# EasyEDA Pro project ProPrj_STM32的智能蓝牙药盒系统_2026-03-19.epro

# Schematic Schematic1
Assembly Variant: Basic; Board Name: Board1; Create Date: 2026-03-02; Page Name: P1; Project Name: STM32的智能蓝牙药盒系统; Schematic Name: Schematic1; Update Date: 2026-03-02; BladeWidth: 10; Company: 嘉立创EDA; Page Size: A4; RegionStart: 1; ShowBorder: 1; TitleBlock: 1; TitleBlockPosition: 3; Version: V1.0; XRegionCount: 6; YRegionCount: 4
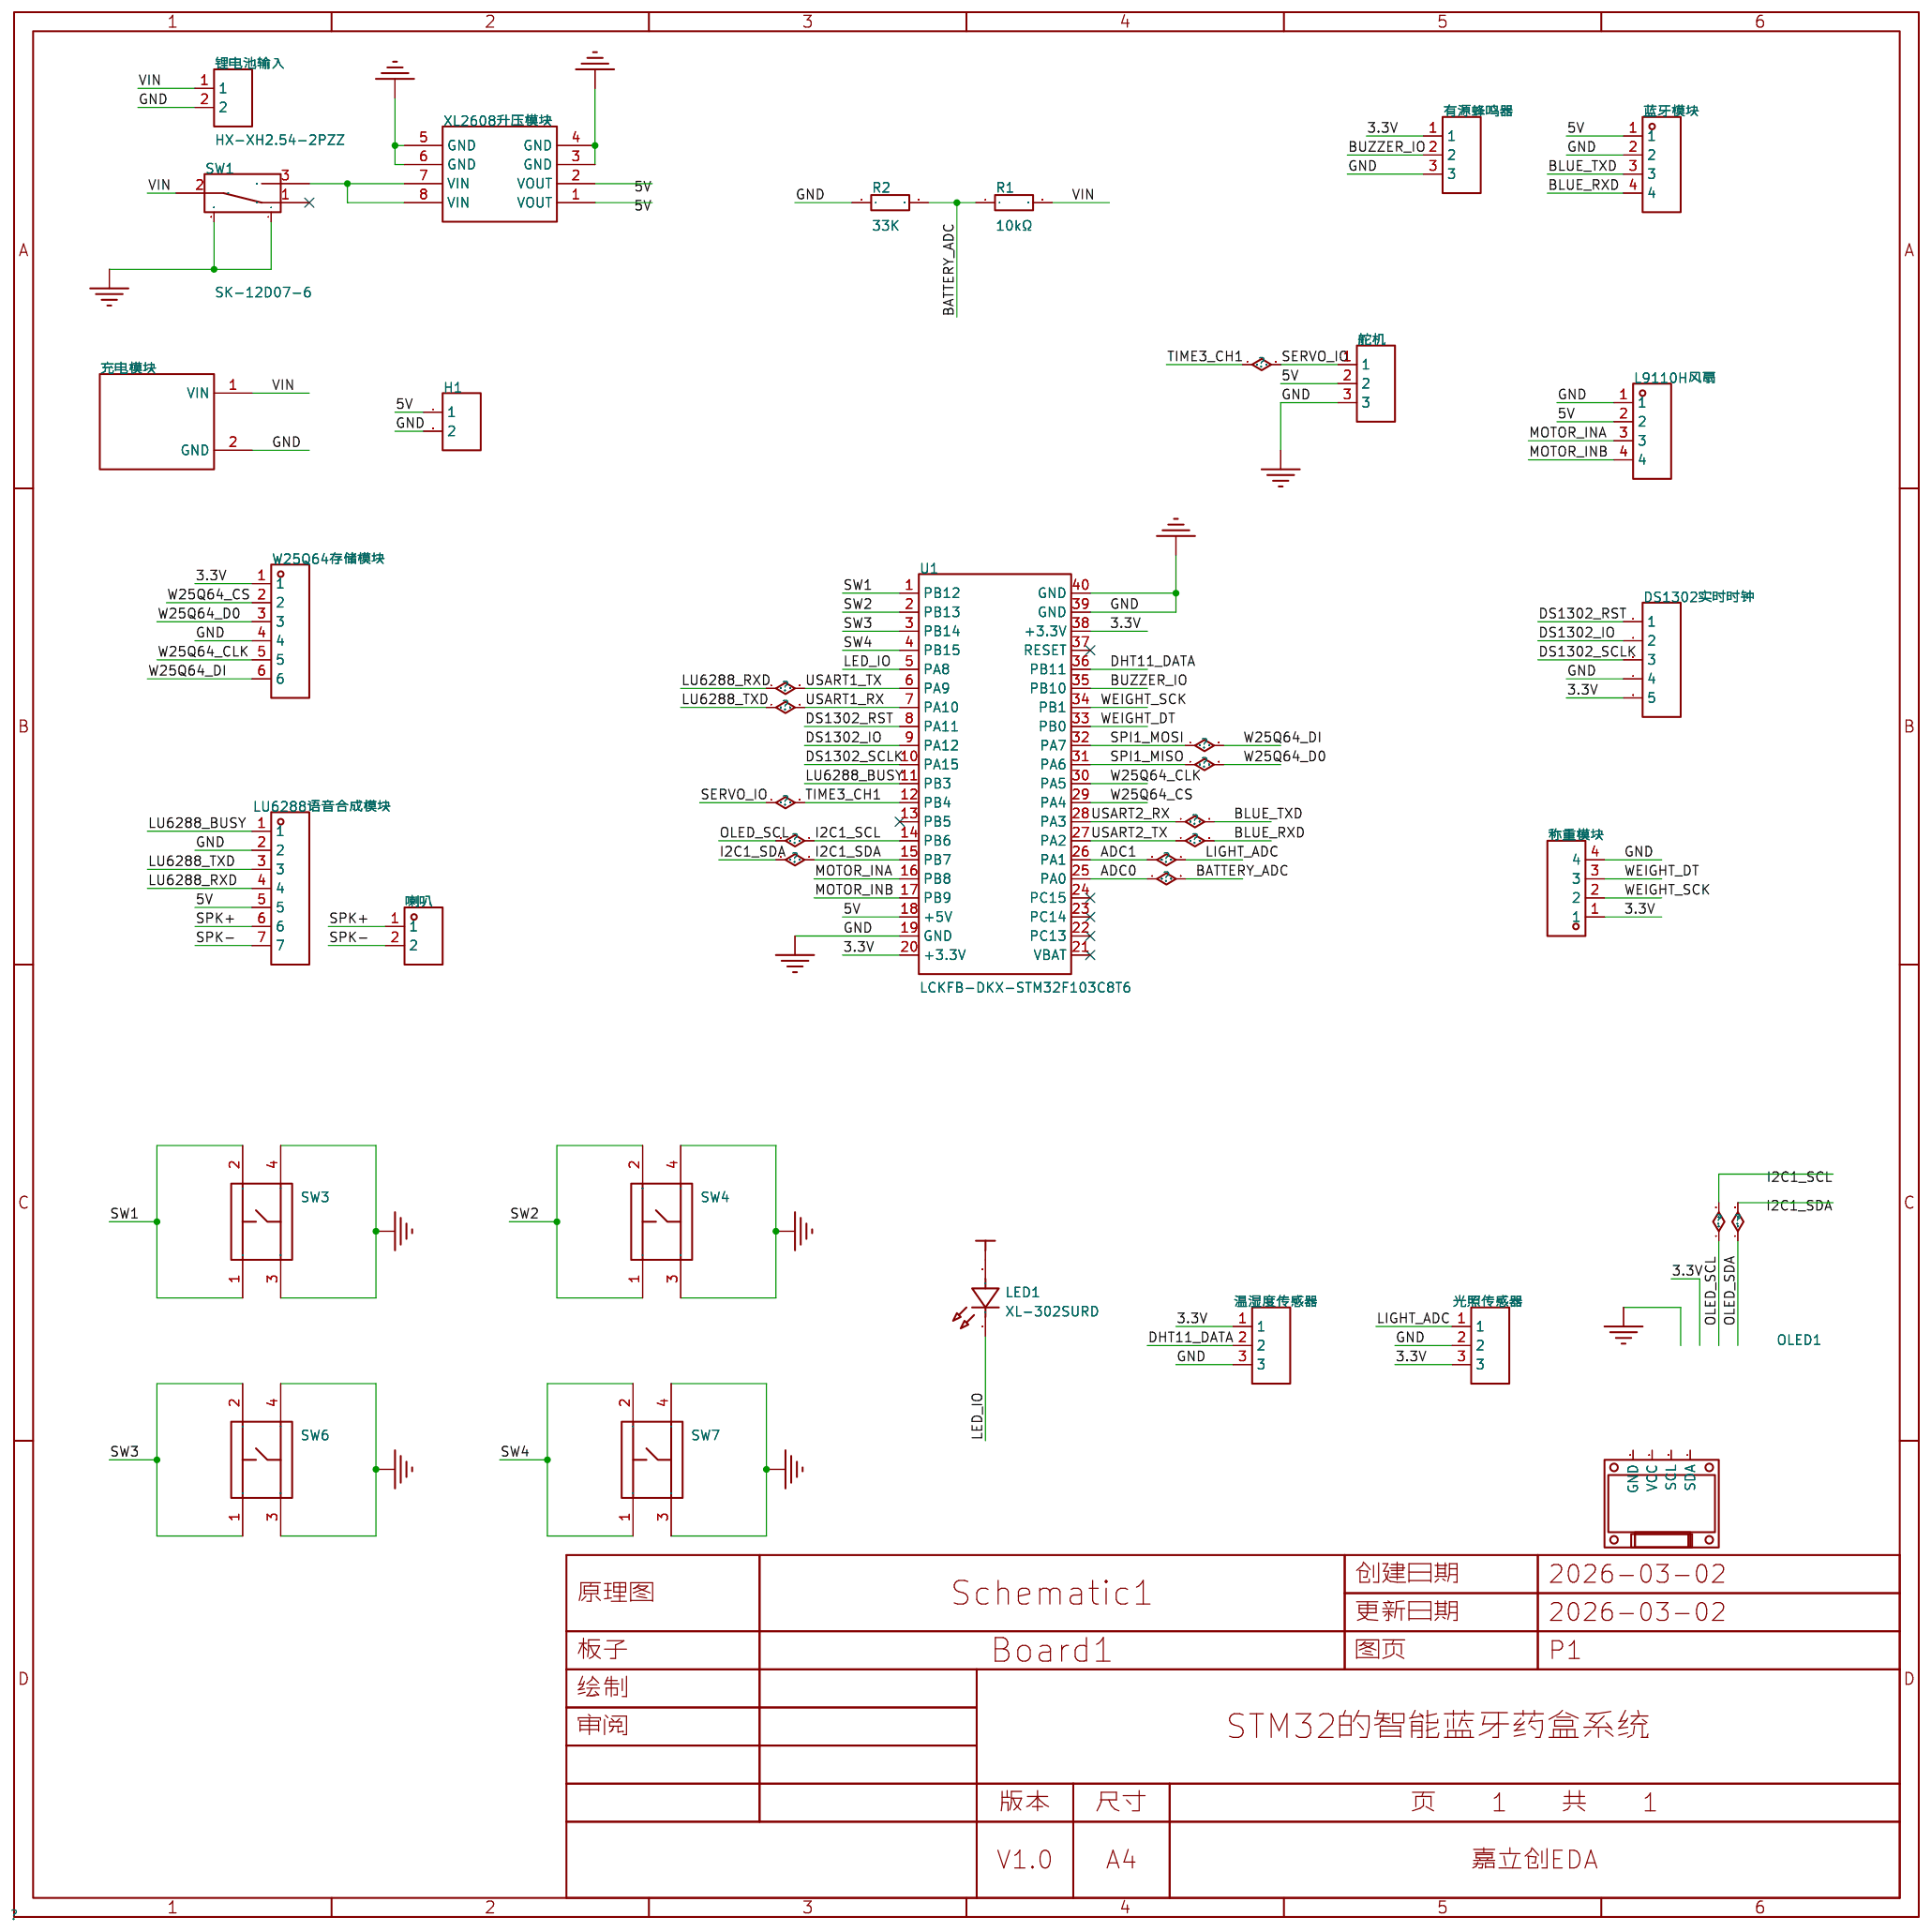
[diagram p0: schematic sheet]

## Parts
DS1302实时时钟  2.54-1*5P母  [HDR-TH_5P-P2.54-V-F]
H1  -  [HDR-TH_2P-P2.54-V-F]
L9110H风扇  -  [HDR-TH_4P-P2.54-V-F]
LED1  XL-302SURD  [LED-TH_BD3.8-P2.54-RD]
LU6288语音合成模块  PM254V-11-07-H85  [HDR-TH_7P-P2.54-V-F]
OLED1  -  [0.96OLED_4P]
R1  10kΩ  [R0805]
R2  33K  [R0805]
SW1  SK-12D07-6  [拨动开关_侧]
SW3  K2-1102DP-C4SW-04  [KEY-TH_4P-L6.0-W6.0-P4.50-LS6.50]
SW4  K2-1102DP-C4SW-04  [KEY-TH_4P-L6.0-W6.0-P4.50-LS6.50]
SW6  K2-1102DP-C4SW-04  [KEY-TH_4P-L6.0-W6.0-P4.50-LS6.50]
SW7  K2-1102DP-C4SW-04  [KEY-TH_4P-L6.0-W6.0-P4.50-LS6.50]
U1  LCKFB-DKX-STM32F103C8T6  [CONN-TH_L53.3-W22.9_STM32F103C8T6-CARD]
W25Q64存储模块  PM254V-11-06-H85  [HDR-TH_6P-P2.54-V-F]
XL2608升压模块  -  [XL3608升压模块]
充电模块  -  [充电模块]
光照传感器  PM254V-11-03-H85  [HDR-TH_3P-P2.54-V-F]
喇叭  WAFER-PH2.0-2PZZ  [CONN-TH_2P-P2.00_HC-PH-2A-M]
有源蜂鸣器  PM254V-11-03-H85  [HDR-TH_3P-P2.54-V-F]
温湿度传感器  PM254V-11-03-H85  [HDR-TH_3P-P2.54-V-F]
称重模块  -  [HDR-TH_4P-P2.54-V-F]
舵机  PM254V-11-03-H85  [HDR-TH_3P-P2.54-V-F]
蓝牙模块  -  [HDR-TH_4P-P2.54-V-F]
锂电池输入  HX-XH2.54-2PZZ  [CONN-TH_2P-P2.50_HX-2.54MM-2P-ZZ-MS]

## Library data of the parts
DS1302实时时钟 = 2.54-1*5P母: 插孔结构:1x5P;间距:2.54mm;行距:-;圆孔/方孔:方孔;安装方式:直插;排数:单排;总孔位数:5P;额定电流:3A;插孔方向:顶部;塑高:8.5mm;触头材质:黄铜;触头镀层:金;工作温度:-55℃~+105℃;; LCSC Part Name: 1x5P 间距:2.54mm 直插; Supplier Part: C50950; Manufacturer: BOOMELE(博穆精密); Supplier Footprint: 插件,P=2.54mm; JLCPCB Part Class: Extended Part; Datasheet: https://item.szlcsc.com/datasheet/2.54-1*5P%25E6%25AF%258D/51962.html; Supplier: LCSC; Holes Structure: 1x5P; Pitch: 2.54mm; Circular Hole / Square Hole: 方孔; Mounting Type: 直插; Number of Rows: 单排; Number of Positions: 5P; Current Rating: 3A; Holes Direction: 顶部; Insulation Height: 8.5mm; Contact Material: 黄铜; Contact Plating: 金; Operating Temperature: -55℃~+105℃; PIN Length: 3.2mm
H1 = HDR-F_2.54_1x2P: Supplier Part: C49661; Supplier Footprint: 插件
L9110H风扇 称重模块 蓝牙模块 = HDR-F_2.54_1x4P: Supplier Part: C2718488; Supplier Footprint: 插件
LED1 = XL-302SURD: 灯头类型:3mm圆形灯头;发光颜色:红色;正向压降(Vf):2.2V;功率:50mW;正向电流:20mA;波长:620nm~630nm;二极管配置:-;透镜颜色:红色透镜;色温:-;发光强度:1000mcd;发光角度:35°;载带方式:-;工作温度:-20℃~+85℃;; LCSC Part Name: 3mm圆形灯头 红色; Supplier Part: C2895470; Manufacturer: XINGLIGHT(成兴光); Supplier Footprint: 插件,D=3mm; JLCPCB Part Class: Extended Part; Datasheet: https://item.szlcsc.com/datasheet/XL-302SURD/3136185.html; Supplier: LCSC; Lamp Holder Type: 3mm圆形灯头; Illumination Color: 红色; Voltage - Forward(Vf): 2.2V; Power(Watts): 50mW; Forward Current: 20mA; Wavelength - Dominant: 620nm~630nm; Peak Wavelength: 625nm; Lens Color: 红色透镜; Luminous Intensity: 1000mcd; Viewing Angle: 35°; Operating Temperature: -20℃~+85℃
LU6288语音合成模块 = PM254V-11-07-H85: 插孔结构:1x7P;间距:2.54mm;行距:-;圆孔/方孔:方孔;安装方式:直插;排数:单排;总孔位数:7P;额定电流:3A;额定电压:250V;插孔方向:顶部;塑高:-;工作温度:-40℃~+105℃;; LCSC Part Name: 间距:2.54mm 1x7P 直插; Supplier Part: C2832270; Manufacturer: XFCN(兴飞); Supplier Footprint: 插件,P=2.54mm; JLCPCB Part Class: Extended Part; Datasheet: https://item.szlcsc.com/datasheet/PM254V-11-07-H85/2989788.html; Supplier: LCSC; Holes Structure: 1x7P; Pitch: 2.54mm; Circular Hole / Square Hole: 方孔; Mounting Type: 直插; Number of Rows: 单排; Number of Positions: 7P; Current Rating: 3A; Voltage Rating (Max): 250V; Holes Direction: 顶部; Operating Temperature: -40℃~+105℃
OLED1 = 0.96OLED模块_4P: Supplier Footprint: 插件
R1 R2 = 0805W8F1002T5E_C17414: 电阻类型:厚膜电阻;阻值:10kΩ;精度:±1%;功率:125mW;工作电压:150V;温度系数:±100ppm/℃;; LCSC Part Name: 10kΩ ±1% 125mW 厚膜电阻; Supplier Part: C17414; Manufacturer: UNI-ROYAL(厚声); Manufacturer Part: 0805W8F1002T5E; Supplier Footprint: 0805; JLCPCB Part Class: Basic Part; Datasheet: https://item.szlcsc.com/datasheet/0805W8F1002T5E/18102.html; Supplier: LCSC; Type: 厚膜电阻; Tolerance: ±1%; Power(Watts): 125mW; Voltage-Supply(Max): 150V; Temperature Coefficient: ±100ppm/℃; Operating Temperature: -55℃~+155℃
SW1 = SK-12D07-6: 安装方式:弯插;额定电流:300mA;额定电压:50V;工作寿命:1万次;; LCSC Part Name: 单排三脚 两档 侧插拨动开关 柄高6MM; Supplier Part: C5289941; Manufacturer: ROCPU Switches(台普); Supplier Footprint: 弯插,8.6x4.7mm; JLCPCB Part Class: Extended Part; Datasheet: https://item.szlcsc.com/datasheet/SK-12D07-6/6030151.html; Supplier: LCSC; Actuator Style: 矩形柱状; Termination Style: PC引脚; Length: 8.6mm; Width: 4.7mm; Switch Height: 9.5mm; Mounting Type: 弯插; Current Rating: 300mA; Voltage Rating: 50V; Life: 1万次
SW3 SW4 SW6 SW7 = K2-1102DP-C4SW-04: 电路结构:单刀单掷;按钮形状:圆形按钮;作用力:2.5N;安装方式:直插;开关长度:6mm;开关宽度:6mm;开关高度:5mm;触点电流:50mA;额定电压:12V;带灯:-;工作寿命:10万次;; LCSC Part Name: 轻触按键开关6*6*5; Supplier Part: C110153; Manufacturer: 韩国韩荣; Supplier Footprint: 插件-4P,6x6mm; JLCPCB Part Class: Extended Part; Datasheet: https://item.szlcsc.com/datasheet/K2-1102DP-C4SW-04/111374.html; Supplier: LCSC; Circuit: 单刀单掷; Actuator Style: 圆形按钮; Operating Force: 2.5N; Mounting Type: 直插; Length: 6mm; Width: 6mm; Switch Height: 5mm; Contact Current: 50mA; Voltage Rating: 12V; Life: 10万次; Operating Temperature: -25℃~+85℃
U1 = LCKFB-DKX-STM32F103C8T6: 搭载Contex M3内核,程序存储容量64KB,RAM总容量20KB,最高72MHz主频,提供高效的计算能力和稳定的运行环境。; LCSC Part Name: 立创·地阔星-STM32F103C8T6开发板; Supplier Part: C22396880; Manufacturer: 立创开发板; JLCPCB Part Class: Extended Part; Datasheet: https://item.szlcsc.com/datasheet/LCKFB-DKX-STM32F103C8T6/24005615.html; Supplier: LCSC
W25Q64存储模块 = PM254V-11-06-H85: 插孔结构:1x6P;间距:2.54mm;行距:-;圆孔/方孔:方孔;安装方式:直插;排数:单排;总孔位数:6P;额定电流:3A;额定电压:250V;插孔方向:顶部;塑高:-;工作温度:-40℃~+105℃;; LCSC Part Name: 间距:2.54mm 1x6P 直插; Supplier Part: C2832269; Manufacturer: XFCN(兴飞); Supplier Footprint: 插件,P=2.54mm; JLCPCB Part Class: Extended Part; Datasheet: https://item.szlcsc.com/datasheet/PM254V-11-06-H85/2989787.html; Supplier: LCSC; Holes Structure: 1x6P; Pitch: 2.54mm; Circular Hole / Square Hole: 方孔; Mounting Type: 直插; Number of Rows: 单排; Number of Positions: 6P; Current Rating: 3A; Voltage Rating (Max): 250V; Holes Direction: 顶部; Operating Temperature: -40℃~+105℃
XL2608升压模块 = XL2608升压模块
充电模块 = 充电模块
光照传感器 有源蜂鸣器 温湿度传感器 舵机 = PM254V-11-03-H85: 插孔结构:1x3P;间距:2.54mm;行距:-;圆孔/方孔:方孔;安装方式:直插;排数:单排;总孔位数:3P;额定电流:3A;插孔方向:顶部;塑高:8.5mm;触头材质:黄铜;触头镀层:-;工作温度:-40℃~+105℃;; LCSC Part Name: 1x3P 间距:2.54mm 直插; Supplier Part: C541850; Manufacturer: XFCN(兴飞); Supplier Footprint: 插件,P=2.54mm; JLCPCB Part Class: Extended Part; Datasheet: https://item.szlcsc.com/datasheet/PM254V-11-03-H85/562471.html; Supplier: LCSC; Holes Structure: 1x3P; Pitch: 2.54mm; Circular Hole / Square Hole: 方孔; Mounting Type: 直插; Number of Rows: 单排; Number of Positions: 3P; Current Rating: 3A; Holes Direction: 顶部; Insulation Height: 8.5mm; Contact Material: 黄铜; Operating Temperature: -40℃~+105℃
喇叭 = WAFER-PH2.0-2PZZ: 插针结构:1x2P;间距:2mm;安装方式:直插;参考系列:PH;总PIN数:2P;排数:1;每排PIN数:2;行距:-;额定电流:2A;触头材质:黄铜;触头镀层:锡;工作温度:-25℃~+85℃;; LCSC Part Name: 1x2P 间距:2mm 直插 系列:PH; Supplier Part: C5359599; Manufacturer: XUNPU(讯普); Supplier Footprint: 插件,P=2mm; JLCPCB Part Class: Extended Part; Datasheet: https://atta.szlcsc.com/upload/public/pdf/source/20241108/09B74E94153224768C62B7F095CB8C18.pdf; Supplier: LCSC; Pins Structure: 1x2P; Pitch: 2mm; Mounting Type: 直插; Reference Series: PH; Number of Pins: 2P; Number of Rows: 1; Number of PINs Per Row: 2; Current Rating: 2A; Contact Material: 黄铜; Contact Plating: 锡; Operating Temperature: -25℃~+85℃; Voltage Rating: 250V; Plastic Material: PA66; Flame Retardant Rating: UL94V-0; Color: 白色; Z-Height of the Board: 6.05mm; X-Length of Bottom Edge on Board (Spacing Line): 6mm; Y-Width of Bottom Edge on Board: 4.7mm
锂电池输入 = HX-XH2.54-2PZZ: 插针结构:1x2P;间距:2.54mm;安装方式:直插;参考系列:XH;总PIN数:2P;排数:1;每排PIN数:2;行距:-;额定电流:3A;触头材质:黄铜;触头镀层:锡;工作温度:-25℃~+85℃;; LCSC Part Name: 1x2P 间距:2.5mm 直插 系列:XH; Supplier Part: C42391660; Manufacturer: hanxia(韩下); Supplier Footprint: 插件,P=2.5mm; JLCPCB Part Class: Extended Part; Datasheet: https://item.szlcsc.com/datasheet/HX-XH2.54-2PZZ/44326932.html; Supplier: LCSC; Pins Structure: 1x2P; Pitch: 2.54mm; Mounting Type: 直插; Reference Series: XH; Number of Pins: 2P; Number of Rows: 1; Number of PINs Per Row: 2; Current Rating: 3A; Contact Material: 黄铜; Contact Plating: 锡; Operating Temperature: -25℃~+85℃; Voltage Rating: 250V; Plastic Material: PA66; Flame Retardant Rating: UL94V-0; Color: 白色

## Nets
3.3V: DS1302实时时钟.5 LED1.2(A) U1.20(+3.3V) U1.38(+3.3V) W25Q64存储模块.1 光照传感器.3 有源蜂鸣器.1 温湿度传感器.1 称重模块.1
5V: H1.1 L9110H风扇.2 LU6288语音合成模块.5 U1.18(+5V) XL2608升压模块.1(VOUT) XL2608升压模块.2(VOUT) 舵机.2 蓝牙模块.1
GND: DS1302实时时钟.4 H1.2 L9110H风扇.1 LU6288语音合成模块.2 R2.1 SW1.4 SW1.5 SW3.3 SW3.4 SW4.3 SW4.4 SW6.3 SW6.4 SW7.3 SW7.4 U1.19(GND) U1.39(GND) U1.40(GND) W25Q64存储模块.4 XL2608升压模块.3(GND) XL2608升压模块.4(GND) XL2608升压模块.5(GND) XL2608升压模块.6(GND) 充电模块.2(GND) 光照传感器.2 有源蜂鸣器.3 温湿度传感器.3 称重模块.4 舵机.3 蓝牙模块.2 锂电池输入.2
VIN: R1.2 SW1.2 充电模块.1(VIN) 锂电池输入.1
ADC0: R1.1 R2.2 U1.25(PA0)
ADC1: U1.26(PA1) 光照传感器.1
BLUE_RXD: U1.27(PA2) 蓝牙模块.4
BLUE_TXD: U1.28(PA3) 蓝牙模块.3
BUZZER_IO: U1.35(PB10) 有源蜂鸣器.2
DHT11_DATA: U1.36(PB11) 温湿度传感器.2
DS1302_IO: DS1302实时时钟.2 U1.9(PA12)
DS1302_RST: DS1302实时时钟.1 U1.8(PA11)
DS1302_SCLK: DS1302实时时钟.3 U1.10(PA15)
I2C1_SCL: U1.14(PB6)
I2C1_SDA: U1.15(PB7)
LED_IO: LED1.1(K) U1.5(PA8)
LU6288_BUSY: LU6288语音合成模块.1 U1.11(PB3)
LU6288_RXD: LU6288语音合成模块.4 U1.6(PA9)
LU6288_TXD: LU6288语音合成模块.3 U1.7(PA10)
MOTOR_INA: L9110H风扇.3 U1.16(PB8)
MOTOR_INB: L9110H风扇.4 U1.17(PB9)
SERVO_IO: U1.12(PB4) 舵机.1
SPI1_MISO: U1.31(PA6) W25Q64存储模块.3
SPI1_MOSI: U1.32(PA7) W25Q64存储模块.6
SPK+: LU6288语音合成模块.6 喇叭.1
SPK-: LU6288语音合成模块.7 喇叭.2
SW1: SW3.1 SW3.2 U1.1(PB12)
SW2: SW4.1 SW4.2 U1.2(PB13)
SW3: SW6.1 SW6.2 U1.3(PB14)
SW4: SW7.1 SW7.2 U1.4(PB15)
W25Q64_CLK: U1.30(PA5) W25Q64存储模块.5
W25Q64_CS: U1.29(PA4) W25Q64存储模块.2
WEIGHT_DT: U1.33(PB0) 称重模块.3
WEIGHT_SCK: U1.34(PB1) 称重模块.2
$1N178: SW1.3 XL2608升压模块.7(VIN) XL2608升压模块.8(VIN)

Not connected (* = marked no-connect by the designer): OLED1 1(GND) 2(VCC) 3(SCL) 4(SDA); SW1 1*; U1 13(PB5)* 21(VBAT)* 22(PC13)* 23(PC14)* 24(PC15)* 37(RESET)*

# Board PCB1
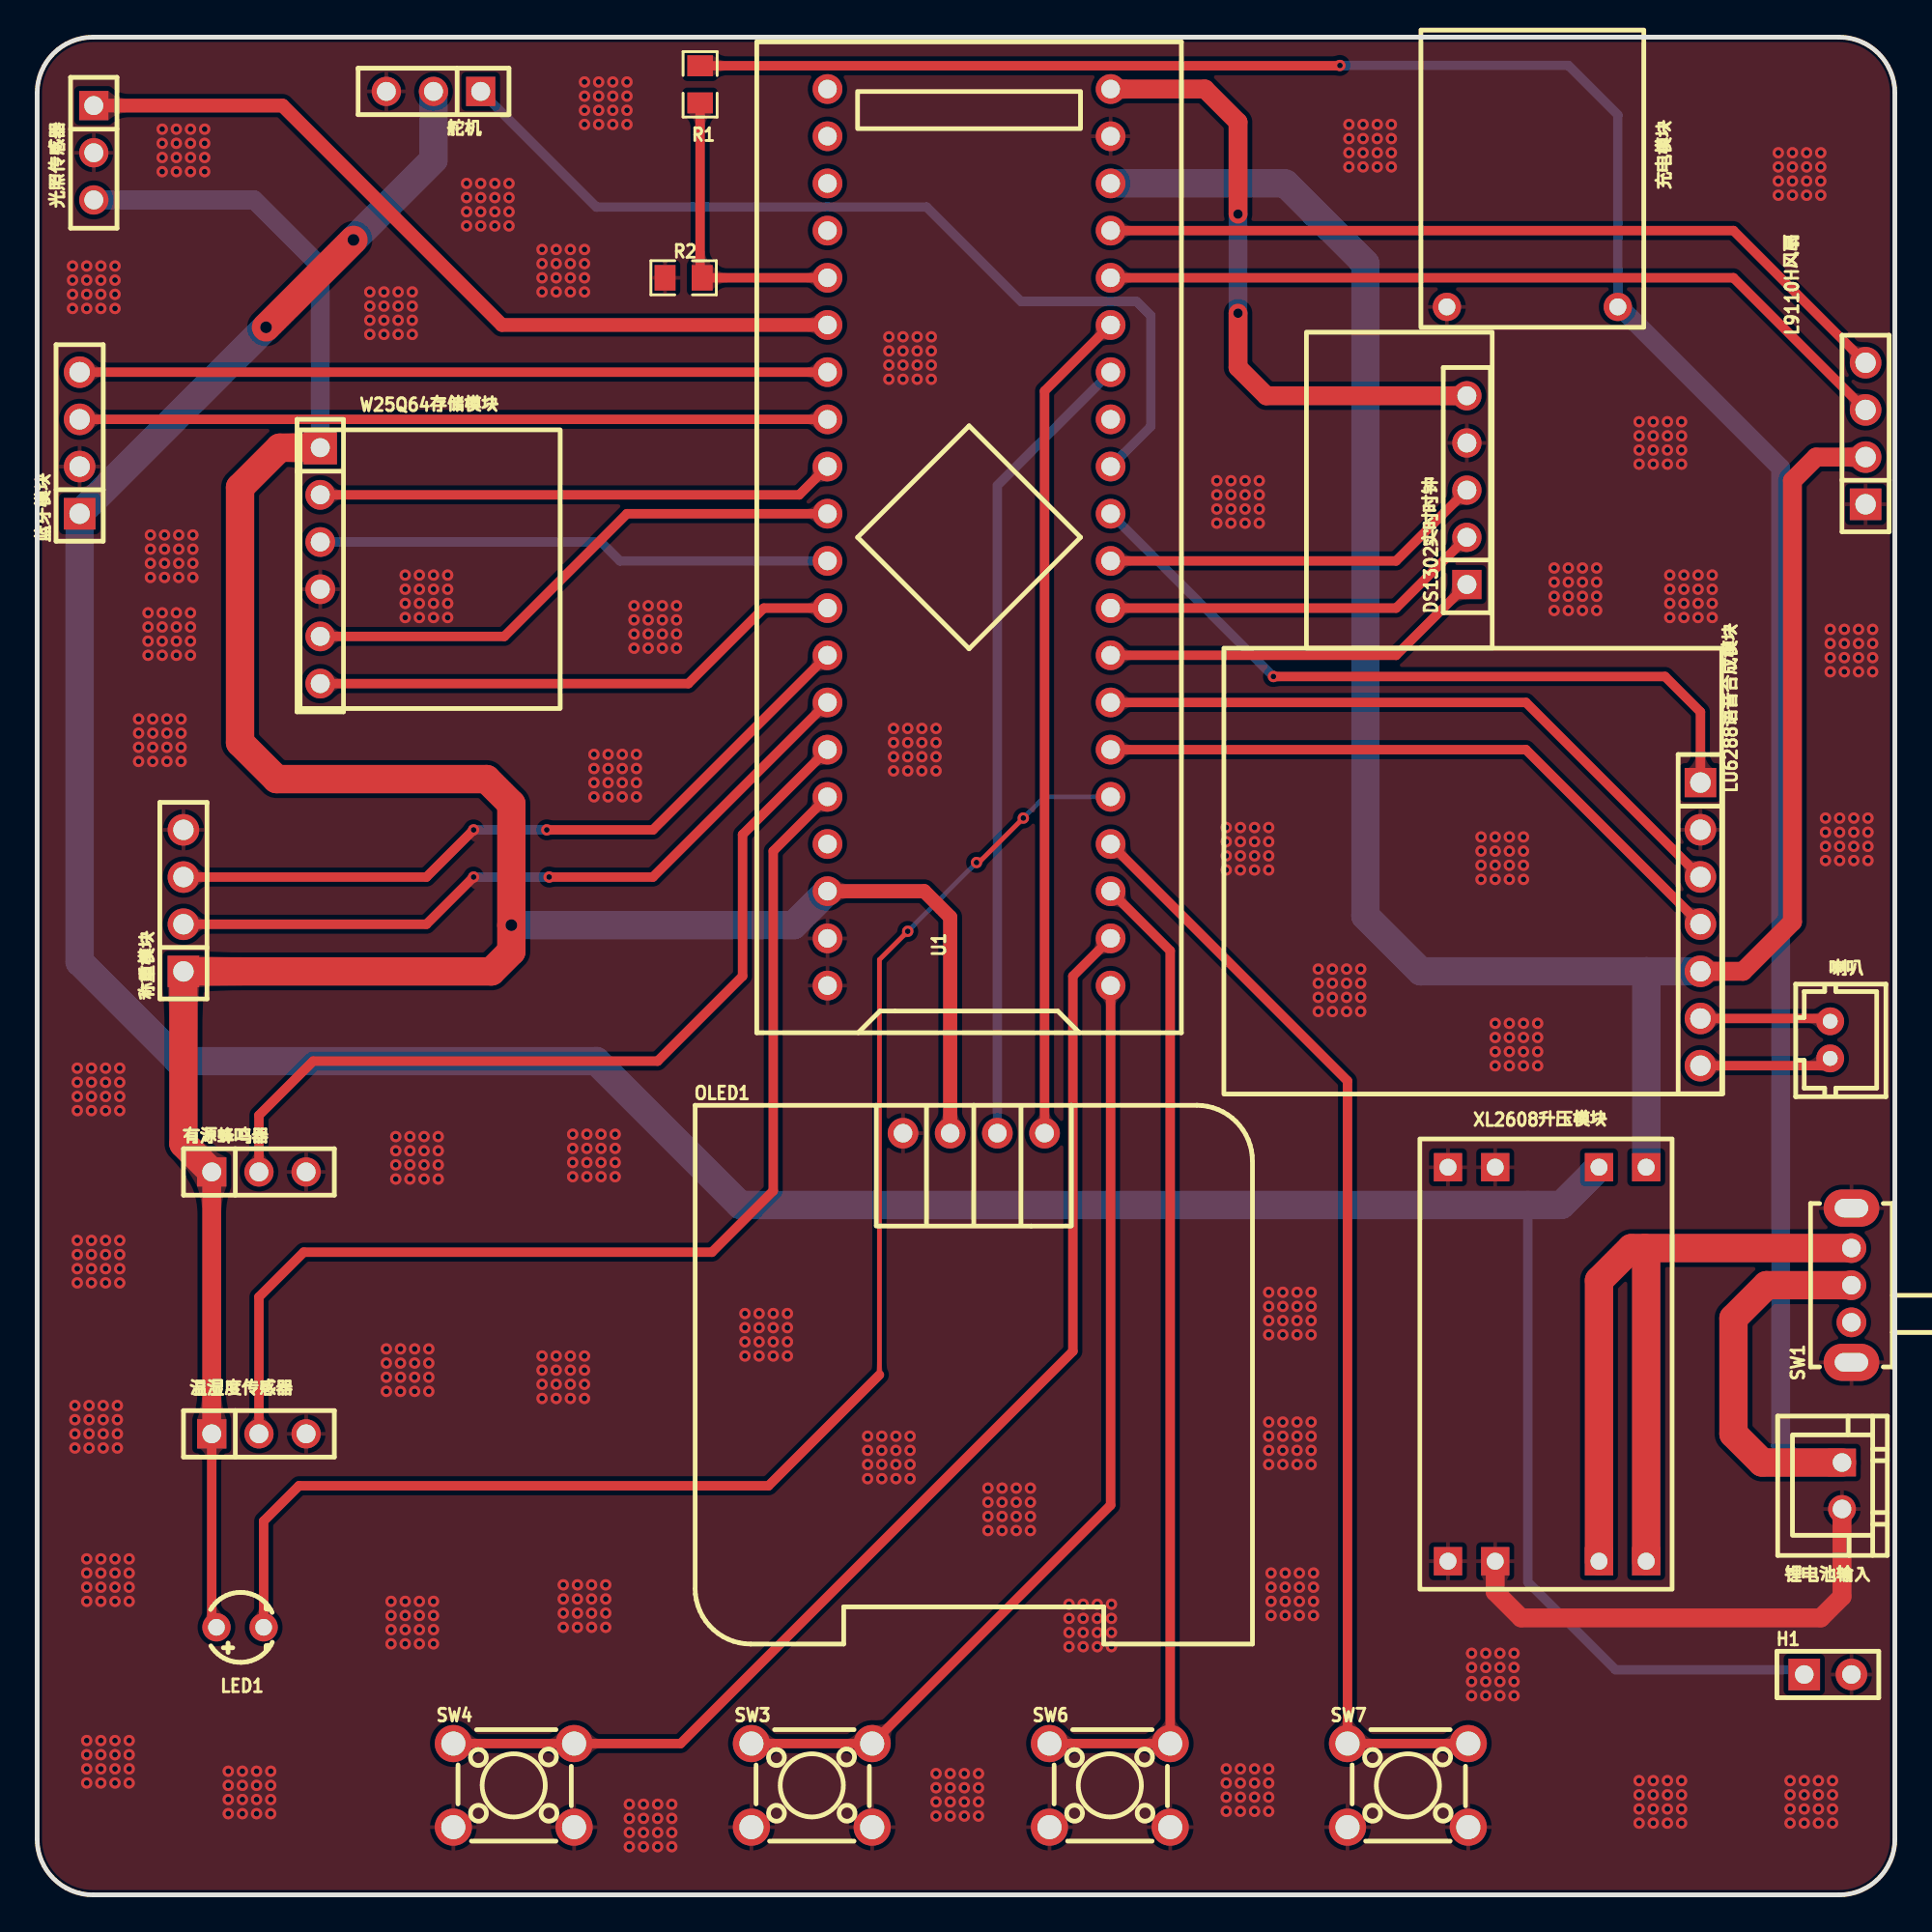
[diagram p1: board, top side]
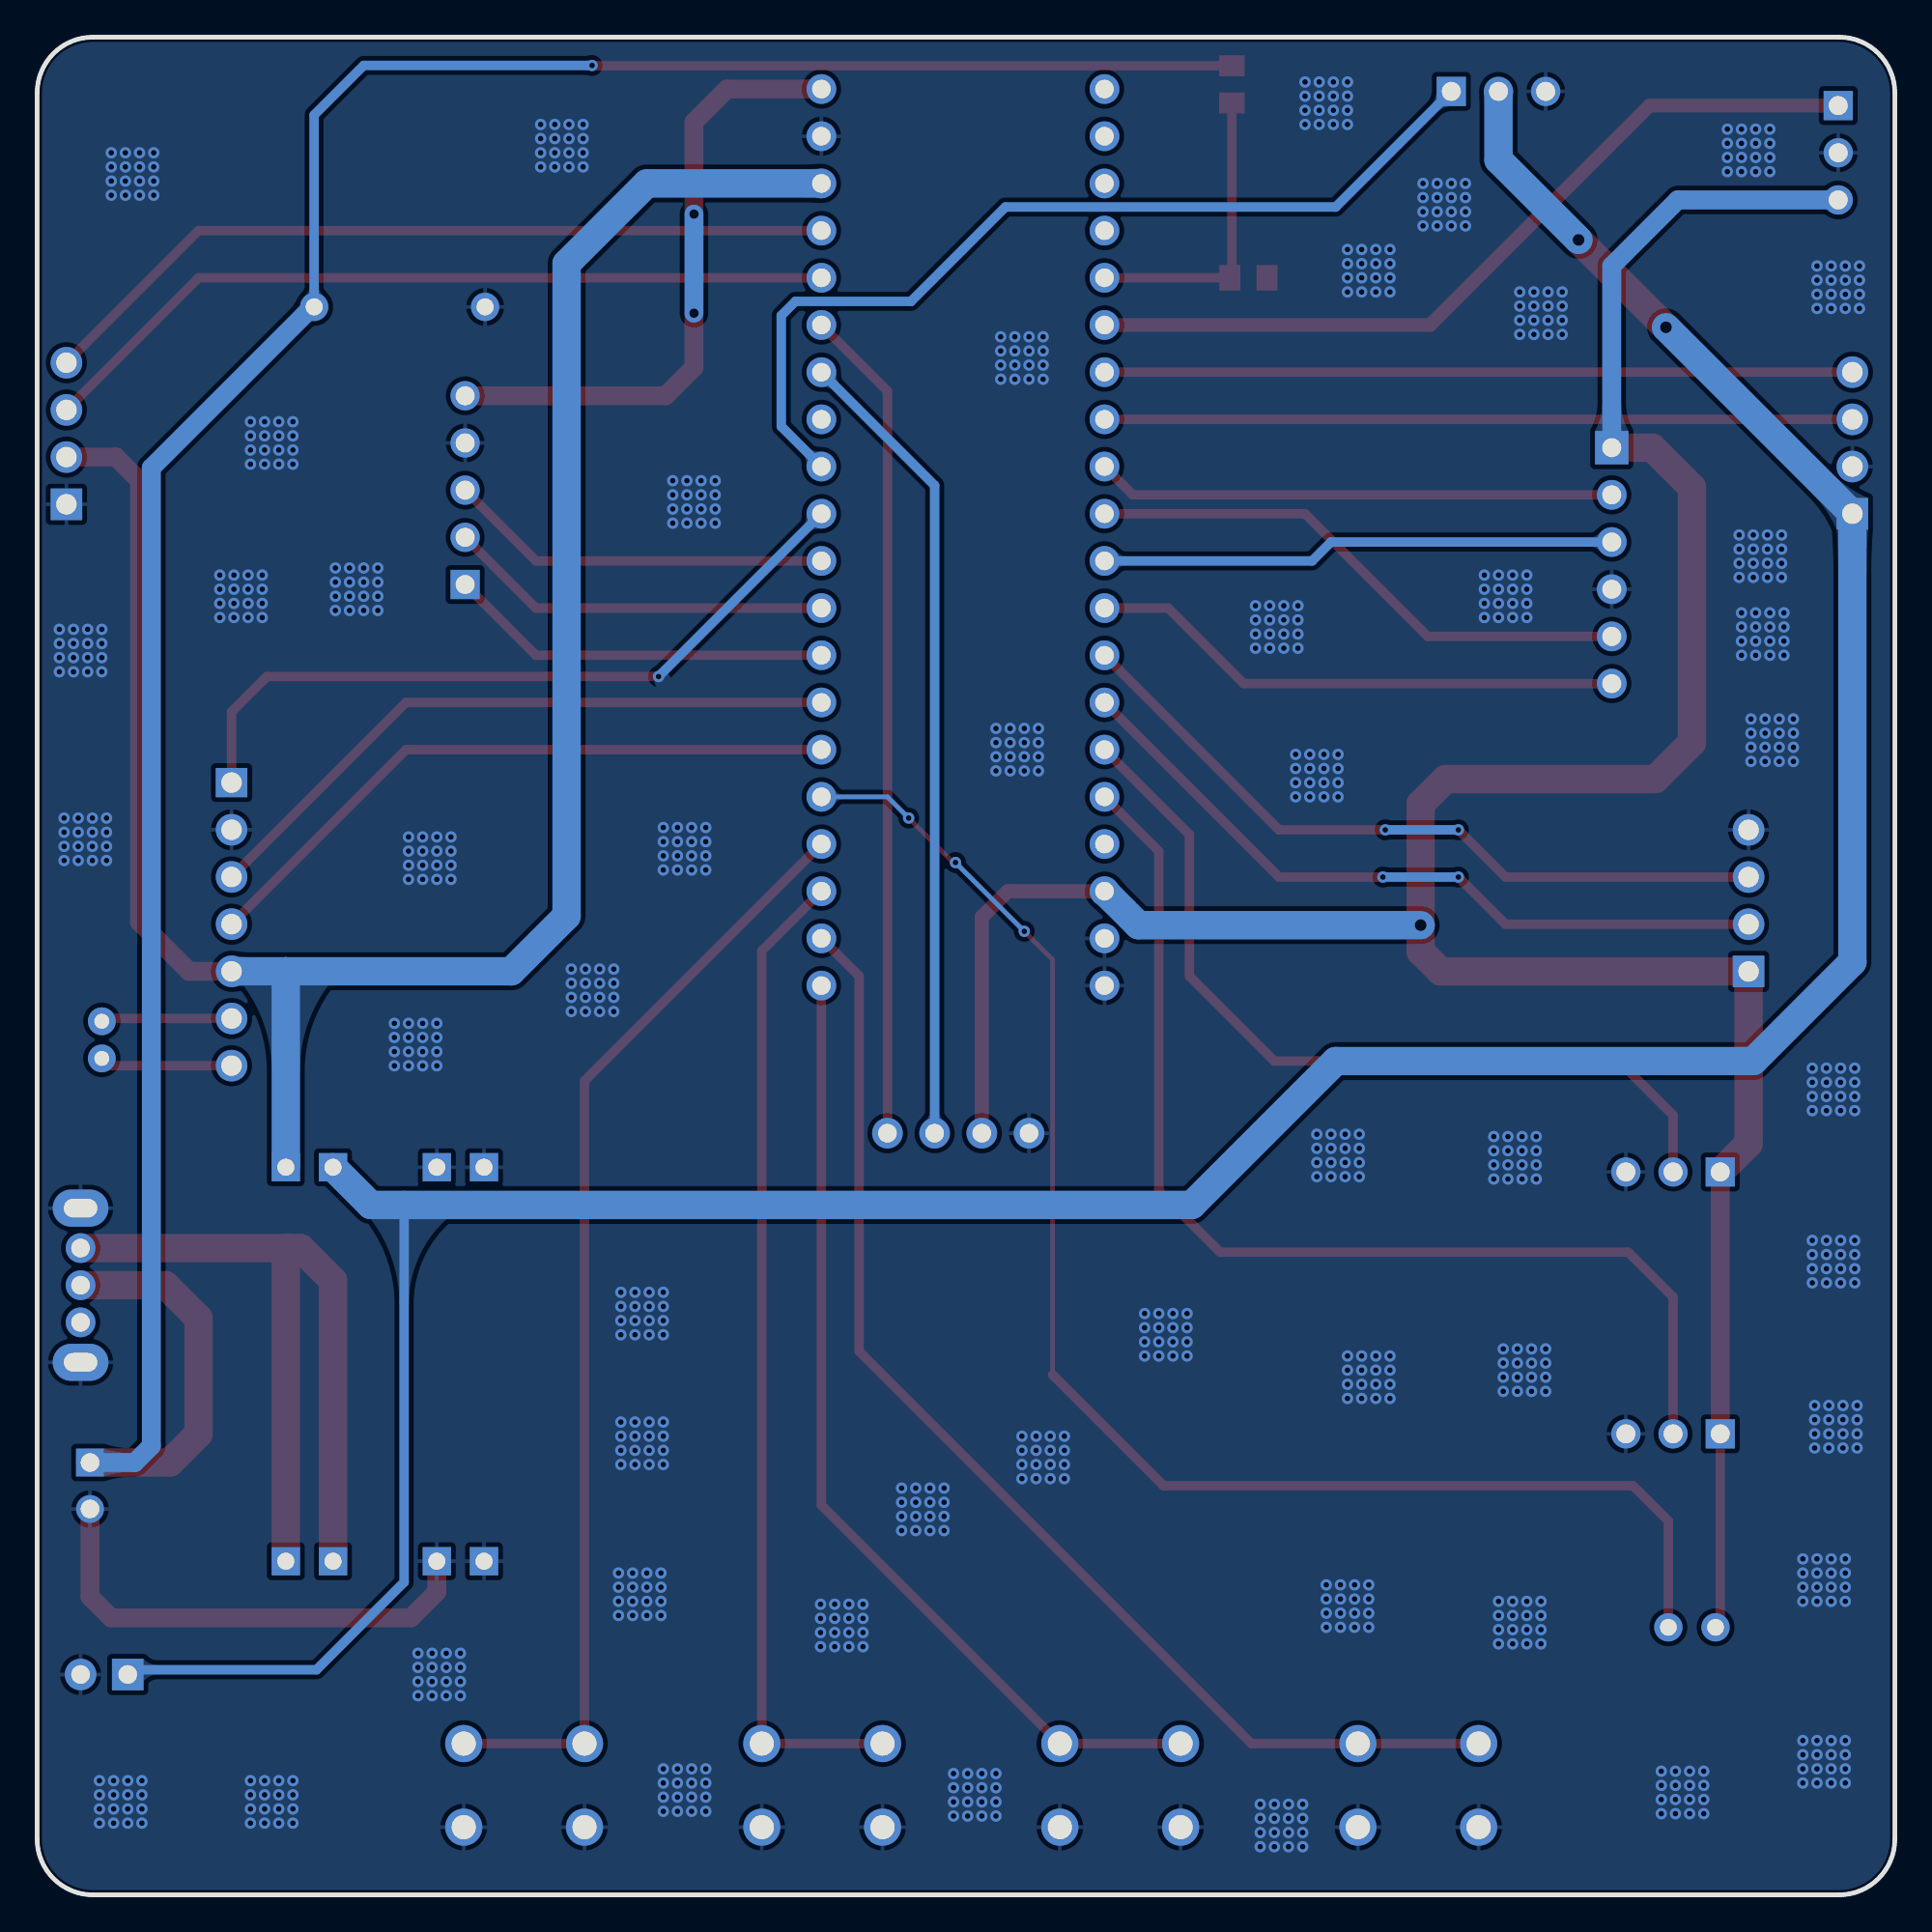
[diagram p2: board, bottom side, seen from below]

Outline 100 x 100 mm; copper layers: Top Layer, Bottom Layer. Coordinates in mm from the lower left corner of the outline.
Outline path: 0,97 0,3 arc(0.88,0.88) 3,0 97,0 arc(99.12,0.88) 100,3 100,97 arc(99.12,99.12) 97,100 3,100 arc(0.88,99.12) 0,97
Stack: Top Layer 0.035mm / Dielectric1 1.51mm FR4 er 4.5 / Bottom Layer 0.035mm

## Design rules (mm)
spacing copperThickness1oz (default): track to track 0.102, other pairs 0.152 to 0.3
spacing copperThickness2oz: track to track 0.203, other pairs 0.152 to 0.3
track width copperThickness1oz (default): min 0.127, default 0.254, max 2.54
track width copperThickness2oz: min 0.203, default 0.254, max 2.54
differential pair differentialPair (default): width min 0.127, default 0.254, max 2.54; gap min 0.152, default 0.152
net GND uses copperRegion

## Placement (name value [footprint] x y rotation side)
DS1302实时时钟  2.54-1*5P母  [HDR-TH_5P-P2.54-V-F]  76.96 75.62 90 top
H1  -  [HDR-TH_2P-P2.54-V-F]  96.39 11.86 0 top
L9110H风扇  -  [HDR-TH_4P-P2.54-V-F]  98.43 78.66 90 top
LED1  XL-302SURD  [LED-TH_BD3.8-P2.54-RD]  10.92 14.4 180 top
LU6288语音合成模块  PM254V-11-07-H85  [HDR-TH_7P-P2.54-V-F]  89.53 52.25 270 top
OLED1  -  [0.96OLED_4P]  50.42 41 0 top
R1  10kΩ  [R0805]  35.69 97.46 90 top
R2  33K  [R0805]  34.8 87.05 0 top
SW1  SK-12D07-6  [拨动开关_侧]  97.66 32.82 90 top
SW3  K2-1102DP-C4SW-04  [KEY-TH_4P-L6.0-W6.0-P4.50-LS6.50]  41.7 5.89 0 top
SW4  K2-1102DP-C4SW-04  [KEY-TH_4P-L6.0-W6.0-P4.50-LS6.50]  25.65 5.89 0 top
SW6  K2-1102DP-C4SW-04  [KEY-TH_4P-L6.0-W6.0-P4.50-LS6.50]  57.74 5.89 0 top
SW7  K2-1102DP-C4SW-04  [KEY-TH_4P-L6.0-W6.0-P4.50-LS6.50]  73.79 5.89 0 top
U1  LCKFB-DKX-STM32F103C8T6  [CONN-TH_L53.3-W22.9_STM32F103C8T6-CARD]  50.16 73.08 90 top
W25Q64存储模块  PM254V-11-06-H85  [HDR-TH_6P-P2.54-V-F]  15.24 71.55 270 top
XL2608升压模块  -  [XL3608升压模块]  88.01 40.69 270 top
充电模块  -  [充电模块]  86.49 100.38 270 top
光照传感器  PM254V-11-03-H85  [HDR-TH_3P-P2.54-V-F]  3.05 93.78 270 top
喇叭  WAFER-PH2.0-2PZZ  [CONN-TH_2P-P2.00_HC-PH-2A-M]  96.52 46.03 270 top
有源蜂鸣器  PM254V-11-03-H85  [HDR-TH_3P-P2.54-V-F]  11.94 38.91 0 top
温湿度传感器  PM254V-11-03-H85  [HDR-TH_3P-P2.54-V-F]  11.94 24.82 0 top
称重模块  -  [HDR-TH_4P-P2.54-V-F]  7.87 53.52 90 top
舵机  PM254V-11-03-H85  [HDR-TH_3P-P2.54-V-F]  21.34 97.08 180 top
蓝牙模块  -  [HDR-TH_4P-P2.54-V-F]  2.29 78.16 90 top
锂电池输入  HX-XH2.54-2PZZ  [CONN-TH_2P-P2.50_HX-2.54MM-2P-ZZ-MS]  97.16 22.02 270 top

## Footprints (pads in the part's own frame, mm; a bottom-side part is the same pattern mirrored in y, then rotated)
0.96OLED_4P
  round 1.65 hole 1: 1(-3.81,-0.002) 2(-1.27,0.002) 3(1.27,0.002) 4(3.81,0.002)
CONN-TH_2P-P2.00_HC-PH-2A-M
  round 1.5 hole 0.8: 1(-1,0) 2(1,0)
CONN-TH_2P-P2.50_HX-2.54MM-2P-ZZ-MS
  rect 1.5x1.5 hole 1: 1(-1.25,0)
  round 1.5 hole 1: 2(1.25,0)
CONN-TH_L53.3-W22.9_STM32F103C8T6-CARD
  round 1.6 hole 1: 1(-24.13,-7.62) 2(-21.59,-7.62) 3(-19.05,-7.62) 4(-16.51,-7.62) 5(-13.97,-7.62) 6(-11.43,-7.62) 7(-8.89,-7.62) 8(-6.35,-7.62) 9(-3.81,-7.62) 10(-1.27,-7.62) 11(1.27,-7.62) 12(3.81,-7.62) 13(6.35,-7.62) 14(8.89,-7.62) 15(11.43,-7.62) 16(13.97,-7.62) 17(16.51,-7.62) 18(19.05,-7.62) 19(21.59,-7.62) 20(24.13,-7.62) 21(24.13,7.62) 22(21.59,7.62) 23(19.05,7.62) 24(16.51,7.62) 25(13.97,7.62) 26(11.43,7.62) 27(8.89,7.62) 28(6.35,7.62) 29(3.81,7.62) 30(1.27,7.62) 31(-1.27,7.62) 32(-3.81,7.62) 33(-6.35,7.62) 34(-8.89,7.62) 35(-11.43,7.62) 36(-13.97,7.62) 37(-16.51,7.62) 38(-19.05,7.62) 39(-21.59,7.62) 40(-24.13,7.62)
HDR-TH_2P-P2.54-V-F
  rect 1.7x1.7 hole 1: 1(-1.27,0)
  round 1.7 hole 1: 2(1.27,0)
HDR-TH_3P-P2.54-V-F
  rect 1.575x1.575 hole 1.02: 1(-2.54,0)
  round 1.575 hole 1.02: 2(0,0) 3(2.54,0)
HDR-TH_4P-P2.54-V-F
  rect 1.7x1.7 hole 1.1: 1(-3.81,0)
  round 1.7 hole 1.1: 2(-1.27,0) 3(1.27,0) 4(3.81,0)
HDR-TH_5P-P2.54-V-F
  rect 1.575x1.575 hole 1.02: 1(-5.08,0)
  round 1.575 hole 1.02: 2(-2.54,0) 3(0,0) 4(2.54,0) 5(5.08,0)
HDR-TH_6P-P2.54-V-F
  rect 1.8x1.8 hole 1.02: 1(-6.35,0)
  round 1.6 hole 1.02: 2(-3.81,0) 3(-1.27,0) 4(1.27,0) 5(3.81,0) 6(6.35,0)
HDR-TH_7P-P2.54-V-F
  rect 1.575x1.7 hole 1.1: 1(-7.62,0)
  round 1.7 hole 1.1: 2(-5.08,0) 3(-2.54,0) 4(0,0) 5(2.54,0) 6(5.08,0) 7(7.62,0)
KEY-TH_4P-L6.0-W6.0-P4.50-LS6.50
  round 2 hole 1.3: 1(-3.25,2.25) 2(3.25,2.25) 3(-3.25,-2.25) 4(3.25,-2.25)
LED-TH_BD3.8-P2.54-RD
  round 1.524 hole 0.9: 1(-1.27,0) 2(1.27,0)
R0805
  rect 1.133x1.377 smd: 1(-1,0) 2(1,0)
XL3608升压模块
  rect 1.524x1.524 hole 0.914: 1(1.524,-1.397) 2(1.524,-3.937) 3(1.524,-9.525) 4(1.524,-12.065) 5(22.733,-12.065) 6(22.733,-9.525) 7(22.733,-3.937) 8(22.733,-1.397)
充电模块
  round 1.524 hole 0.914: 1(14.9,-1.4) 2(14.9,-10.6)
拨动开关_侧
  oval 1.6x1.6 hole 1.001: 1(-1.999,0) 2(0,0) 3(1.999,0)
  oval 1.999x2.999 hole 1.001x1.801: 4(4.151,0) 5(-4.151,0)

## Nets
As in the schematic, except:
3.3V: DS1302实时时钟.5 LED1.2 OLED1.2 U1.20 U1.38 W25Q64存储模块.1 光照传感器.3 有源蜂鸣器.1 温湿度传感器.1 称重模块.1
GND: DS1302实时时钟.4 H1.2 L9110H风扇.1 LU6288语音合成模块.2 OLED1.1 R2.1 SW1.4 SW1.5 SW3.3 SW3.4 SW4.3 SW4.4 SW6.3 SW6.4 SW7.3 SW7.4 U1.19 U1.39 U1.40 W25Q64存储模块.4 XL2608升压模块.3 XL2608升压模块.4 XL2608升压模块.5 XL2608升压模块.6 充电模块.2 光照传感器.2 有源蜂鸣器.3 温湿度传感器.3 称重模块.4 舵机.3 蓝牙模块.2 锂电池输入.2
I2C1_SCL: OLED1.3 U1.14
I2C1_SDA: OLED1.4 U1.15

Pads without a net: SW1 1; U1 13 21 22 23 24 37

## Via types
v1: diameter 1.27, hole 0.635, Top Layer to Bottom Layer, 3 vias
v2: diameter 0.762, hole 0.508, Top Layer to Bottom Layer, 2 vias
v3: diameter 0.61, hole 0.305, Top Layer to Bottom Layer, 825 vias

## Routing (per net, layer and track width the routed paths; a pad name or vN(x,y) marks a point on that pad's centre or on a via; arc(x,y) is an arc through that point)
3.3V: length 190.8
  Top Layer w0.508: LED1.2 9.4,14.66 温湿度传感器.1
  Top Layer w0.762: U1.38 47.75,54.03 49.15,52.63 OLED1.2
  Top Layer w1.016: DS1302实时时钟.5 66.17,80.7 64.64,82.22 v2(64.64,85.14) ; 温湿度传感器.1 有源蜂鸣器.1 ; v2(64.64,90.48) 64.64,95.43 62.87,97.21 U1.20
  Top Layer w1.524: 有源蜂鸣器.1 7.87,40.44 称重模块.1 24.45,49.71 25.53,50.79 v1(25.53,52.2) 25.53,58.72 24.19,60.06 12.89,60.06 10.92,62.03 10.92,75.77 13.06,77.9 W25Q64存储模块.1
  Bottom Layer w1.016: W25Q64存储模块.1 15.24,87.68 11.68,91.24 光照传感器.3 ; v2(64.64,90.48) v2(64.64,85.14)
  Bottom Layer w1.524: U1.38 40.72,52.2 v1(25.53,52.2)
5V: length 294.7
  Top Layer w1.016: L9110H风扇.2 95.76,77.39 94.49,76.12 94.49,52.38 91.83,49.71 LU6288语音合成模块.5
  Top Layer w1.524: v1(12.32,84.38) v1(17.03,89.09)
  Bottom Layer w0.508: 80.25,37.14 80.25,16.83 84.96,12.12 94.87,12.12 H1.1
  Bottom Layer w1.524: XL2608升压模块.1 86.61,49.71 86.62,49.71 ; LU6288语音合成模块.5 86.62,49.71 ; 86.62,49.71 74.48,49.71 71.5,52.69 71.5,87.81 67.18,92.13 U1.18 ; v1(17.03,89.09) 21.34,93.4 舵机.2 ; v1(12.32,84.38) 蓝牙模块.1 2.29,50.22 7.62,44.88 30.1,44.88 37.85,37.14 82.04,37.14 XL2608升压模块.2
GND: length 26.1
  Top Layer w1.016: 锂电池输入.2 97.16,16.05 96.01,14.91 79.88,14.91 78.49,16.31 XL2608升压模块.6
  vias: v3(1.91,87.68) v3(1.91,86.92) v3(1.91,86.16) v3(1.91,85.39) v3(2.03,26.34) v3(2.03,25.58) v3(2.03,24.82) v3(2.03,24.05) v3(2.16,44.5) v3(2.16,43.74) v3(2.16,42.98) v3(2.16,42.22) v3(2.16,35.23) v3(2.16,34.47) v3(2.16,33.71) v3(2.16,32.94) v3(2.67,87.68) v3(2.67,86.92) v3(2.67,86.16) v3(2.67,85.39) v3(2.67,18.09) v3(2.67,17.32) v3(2.67,16.56) v3(2.67,15.8) v3(2.67,8.31) v3(2.67,7.54) v3(2.67,6.78) v3(2.67,6.02) v3(2.79,26.34) v3(2.79,25.58) v3(2.79,24.82) v3(2.79,24.05) v3(2.92,44.5) v3(2.92,43.74) v3(2.92,42.98) v3(2.92,42.22) v3(2.92,35.23) v3(2.92,34.47) v3(2.92,33.71) v3(2.92,32.94) v3(3.43,87.68) v3(3.43,86.92) v3(3.43,86.16) v3(3.43,85.39) v3(3.43,18.09) v3(3.43,17.32) v3(3.43,16.56) v3(3.43,15.8) v3(3.43,8.31) v3(3.43,7.54) v3(3.43,6.78) v3(3.43,6.02) v3(3.56,26.34) v3(3.56,25.58) v3(3.56,24.82) v3(3.56,24.05) v3(3.68,44.5) v3(3.68,43.74) v3(3.68,42.98) v3(3.68,42.22) v3(3.68,35.23) v3(3.68,34.47) v3(3.68,33.71) v3(3.68,32.94) v3(4.19,87.68) v3(4.19,86.92) v3(4.19,86.16) v3(4.19,85.39) v3(4.19,18.09) v3(4.19,17.32) v3(4.19,16.56) v3(4.19,15.8) v3(4.19,8.31) v3(4.19,7.54) v3(4.19,6.78) v3(4.19,6.02) v3(4.32,26.34) v3(4.32,25.58) v3(4.32,24.82) v3(4.32,24.05) v3(4.44,44.5) v3(4.44,43.74) v3(4.44,42.98) v3(4.44,42.22) v3(4.44,35.23) v3(4.44,34.47) v3(4.44,33.71) v3(4.44,32.94) v3(4.95,18.09) v3(4.95,17.32) v3(4.95,16.56) v3(4.95,15.8) v3(4.95,8.31) v3(4.95,7.54) v3(4.95,6.78) v3(4.95,6.02) v3(5.46,63.3) v3(5.46,62.53) v3(5.46,61.77) v3(5.46,61.01) v3(5.97,69.01) v3(5.97,68.25) v3(5.97,67.49) v3(5.97,66.73) v3(6.1,73.2) v3(6.1,72.44) v3(6.1,71.68) v3(6.1,70.92) v3(6.22,63.3) v3(6.22,62.53) v3(6.22,61.77) v3(6.22,61.01) v3(6.73,95.05) v3(6.73,94.28) v3(6.73,93.52) v3(6.73,92.76) v3(6.73,69.01) v3(6.73,68.25) v3(6.73,67.49) v3(6.73,66.73) v3(6.86,73.2) v3(6.86,72.44) v3(6.86,71.68) v3(6.86,70.92) v3(6.98,63.3) v3(6.98,62.53) v3(6.98,61.77) v3(6.98,61.01) v3(7.49,95.05) v3(7.49,94.28) v3(7.49,93.52) v3(7.49,92.76) v3(7.49,69.01) v3(7.49,68.25) v3(7.49,67.49) v3(7.49,66.73) v3(7.62,73.2) v3(7.62,72.44) v3(7.62,71.68) v3(7.62,70.92) v3(7.75,63.3) v3(7.75,62.53) v3(7.75,61.77) v3(7.75,61.01) v3(8.25,95.05) v3(8.25,94.28) v3(8.25,93.52) v3(8.25,92.76) v3(8.25,69.01) v3(8.25,68.25) v3(8.25,67.49) v3(8.25,66.73) v3(8.38,73.2) v3(8.38,72.44) v3(8.38,71.68) v3(8.38,70.92) v3(9.02,95.05) v3(9.02,94.28) v3(9.02,93.52) v3(9.02,92.76) v3(10.29,6.66) v3(10.29,5.89) v3(10.29,5.13) v3(10.29,4.37) v3(11.05,6.66) v3(11.05,5.89) v3(11.05,5.13) v3(11.05,4.37) v3(11.81,6.66) v3(11.81,5.89) v3(11.81,5.13) v3(11.81,4.37) v3(12.57,6.66) v3(12.57,5.89) v3(12.57,5.13) v3(12.57,4.37) v3(17.91,86.28) v3(17.91,85.52) v3(17.91,84.76) v3(17.91,84) v3(18.67,86.28) v3(18.67,85.52) v3(18.67,84.76) v3(18.67,84) v3(18.8,29.39) v3(18.8,28.63) v3(18.8,27.86) v3(18.8,27.1) v3(19.05,15.8) v3(19.05,15.04) v3(19.05,14.28) v3(19.05,13.51) v3(19.3,40.82) v3(19.3,40.06) v3(19.3,39.29) v3(19.3,38.53) v3(19.43,86.28) v3(19.43,85.52) v3(19.43,84.76) v3(19.43,84) v3(19.56,29.39) v3(19.56,28.63) v3(19.56,27.86) v3(19.56,27.1) v3(19.81,71.04) v3(19.81,70.28) v3(19.81,69.52) v3(19.81,68.76) v3(19.81,15.8) v3(19.81,15.04) v3(19.81,14.28) v3(19.81,13.51) v3(20.07,40.82) v3(20.07,40.06) v3(20.07,39.29) v3(20.07,38.53) v3(20.19,86.28) v3(20.19,85.52) v3(20.19,84.76) v3(20.19,84) v3(20.32,29.39) v3(20.32,28.63) v3(20.32,27.86) v3(20.32,27.1) v3(20.57,71.04) v3(20.57,70.28) v3(20.57,69.52) v3(20.57,68.76) v3(20.57,15.8) v3(20.57,15.04) v3(20.57,14.28) v3(20.57,13.51) v3(20.83,40.82) v3(20.83,40.06) v3(20.83,39.29) v3(20.83,38.53) v3(21.08,29.39) v3(21.08,28.63) v3(21.08,27.86) v3(21.08,27.1) v3(21.34,71.04) v3(21.34,70.28) v3(21.34,69.52) v3(21.34,68.76) v3(21.34,15.8) v3(21.34,15.04) v3(21.34,14.28) v3(21.34,13.51) v3(21.59,40.82) v3(21.59,40.06) v3(21.59,39.29) v3(21.59,38.53) v3(22.1,71.04) v3(22.1,70.28) v3(22.1,69.52) v3(22.1,68.76) v3(23.11,92.13) v3(23.11,91.36) v3(23.11,90.6) v3(23.11,89.84) v3(23.88,92.13) v3(23.88,91.36) v3(23.88,90.6) v3(23.88,89.84) v3(24.64,92.13) v3(24.64,91.36) v3(24.64,90.6) v3(24.64,89.84) v3(25.4,92.13) v3(25.4,91.36) v3(25.4,90.6) v3(25.4,89.84) v3(27.18,88.57) v3(27.18,87.81) v3(27.18,87.05) v3(27.18,86.28) v3(27.18,29.01) v3(27.18,28.25) v3(27.18,27.48) v3(27.18,26.72) v3(27.94,88.57) v3(27.94,87.81) v3(27.94,87.05) v3(27.94,86.28) v3(27.94,29.01) v3(27.94,28.25) v3(27.94,27.48) v3(27.94,26.72) v3(28.32,16.69) v3(28.32,15.93) v3(28.32,15.16) v3(28.32,14.4) v3(28.7,88.57) v3(28.7,87.81) v3(28.7,87.05) v3(28.7,86.28) v3(28.7,29.01) v3(28.7,28.25) v3(28.7,27.48) v3(28.7,26.72) v3(28.83,40.94) v3(28.83,40.18) v3(28.83,39.42) v3(28.83,38.66) v3(29.08,16.69) v3(29.08,15.93) v3(29.08,15.16) v3(29.08,14.4) v3(29.46,97.59) v3(29.46,96.83) v3(29.46,96.06) v3(29.46,95.3) v3(29.46,88.57) v3(29.46,87.81) v3(29.46,87.05) v3(29.46,86.28) v3(29.46,29.01) v3(29.46,28.25) v3(29.46,27.48) v3(29.46,26.72) v3(29.59,40.94) v3(29.59,40.18) v3(29.59,39.42) v3(29.59,38.66) v3(29.84,16.69) v3(29.84,15.93) v3(29.84,15.16) v3(29.84,14.4) v3(29.97,61.39) v3(29.97,60.63) v3(29.97,59.87) v3(29.97,59.11) v3(30.23,97.59) v3(30.23,96.83) v3(30.23,96.06) v3(30.23,95.3) v3(30.35,40.94) v3(30.35,40.18) v3(30.35,39.42) v3(30.35,38.66) v3(30.61,16.69) v3(30.61,15.93) v3(30.61,15.16) v3(30.61,14.4) v3(30.73,61.39) v3(30.73,60.63) v3(30.73,59.87) v3(30.73,59.11) v3(30.99,97.59) v3(30.99,96.83) v3(30.99,96.06) v3(30.99,95.3) v3(31.12,40.94) v3(31.12,40.18) v3(31.12,39.42) v3(31.12,38.66) v3(31.5,61.39) v3(31.5,60.63) v3(31.5,59.87) v3(31.5,59.11) v3(31.75,97.59) v3(31.75,96.83) v3(31.75,96.06) v3(31.75,95.3) v3(31.88,4.88) v3(31.88,4.12) v3(31.88,3.35) v3(31.88,2.59) v3(32.13,69.39) v3(32.13,68.63) v3(32.13,67.87) v3(32.13,67.11) v3(32.26,61.39) v3(32.26,60.63) v3(32.26,59.87) v3(32.26,59.11) v3(32.64,4.88) v3(32.64,4.12) v3(32.64,3.35) v3(32.64,2.59) v3(32.89,69.39) v3(32.89,68.63) v3(32.89,67.87) v3(32.89,67.11) v3(33.4,4.88) v3(33.4,4.12) v3(33.4,3.35) v3(33.4,2.59) v3(33.66,69.39) v3(33.66,68.63) v3(33.66,67.87) v3(33.66,67.11) v3(34.16,4.88) v3(34.16,4.12) v3(34.16,3.35) v3(34.16,2.59) v3(34.42,69.39) v3(34.42,68.63) v3(34.42,67.87) v3(34.42,67.11) v3(38.1,31.29) v3(38.1,30.53) v3(38.1,29.77) v3(38.1,29.01) v3(38.86,31.29) v3(38.86,30.53) v3(38.86,29.77) v3(38.86,29.01) v3(39.62,31.29) v3(39.62,30.53) v3(39.62,29.77) v3(39.62,29.01) v3(40.39,31.29) v3(40.39,30.53) v3(40.39,29.77) v3(40.39,29.01) v3(44.7,24.69) v3(44.7,23.93) v3(44.7,23.16) v3(44.7,22.4) v3(45.47,24.69) v3(45.47,23.93) v3(45.47,23.16) v3(45.47,22.4) v3(45.85,83.87) v3(45.85,83.11) v3(45.85,82.35) v3(45.85,81.58) v3(46.1,62.79) v3(46.1,62.03) v3(46.1,61.27) v3(46.1,60.5) v3(46.23,24.69) v3(46.23,23.93) v3(46.23,23.16) v3(46.23,22.4) v3(46.61,83.87) v3(46.61,83.11) v3(46.61,82.35) v3(46.61,81.58) v3(46.86,62.79) v3(46.86,62.03) v3(46.86,61.27) v3(46.86,60.5) v3(46.99,24.69) v3(46.99,23.93) v3(46.99,23.16) v3(46.99,22.4) v3(47.37,83.87) v3(47.37,83.11) v3(47.37,82.35) v3(47.37,81.58) v3(47.62,62.79) v3(47.62,62.03) v3(47.62,61.27) v3(47.62,60.5) v3(48.13,83.87) v3(48.13,83.11) v3(48.13,82.35) v3(48.13,81.58) v3(48.39,62.79) v3(48.39,62.03) v3(48.39,61.27) v3(48.39,60.5) v3(48.39,6.53) v3(48.39,5.77) v3(48.39,5) v3(48.39,4.24) v3(49.15,6.53) v3(49.15,5.77) v3(49.15,5) v3(49.15,4.24) v3(49.91,6.53) v3(49.91,5.77) v3(49.91,5) v3(49.91,4.24) v3(50.67,6.53) v3(50.67,5.77) v3(50.67,5) v3(50.67,4.24) v3(51.18,21.9) v3(51.18,21.13) v3(51.18,20.37) v3(51.18,19.61) v3(51.94,21.9) v3(51.94,21.13) v3(51.94,20.37) v3(51.94,19.61) v3(52.71,21.9) v3(52.71,21.13) v3(52.71,20.37) v3(52.71,19.61) v3(53.47,21.9) v3(53.47,21.13) v3(53.47,20.37) v3(53.47,19.61) v3(55.54,15.64) v3(55.54,14.88) v3(55.54,14.12) v3(55.54,13.36) v3(56.31,15.64) v3(56.31,14.88) v3(56.31,14.12) v3(56.31,13.36) v3(57.07,15.64) v3(57.07,14.88) v3(57.07,14.12) v3(57.07,13.36) v3(57.83,15.64) v3(57.83,14.88) v3(57.83,14.12) v3(57.83,13.36) v3(63.5,76.12) v3(63.5,75.36) v3(63.5,74.6) v3(63.5,73.84) v3(64.01,57.45) v3(64.01,56.69) v3(64.01,55.93) v3(64.01,55.17) v3(64.01,6.78) v3(64.01,6.02) v3(64.01,5.26) v3(64.01,4.5) v3(64.26,76.12) v3(64.26,75.36) v3(64.26,74.6) v3(64.26,73.84) v3(64.77,57.45) v3(64.77,56.69) v3(64.77,55.93) v3(64.77,55.17) v3(64.77,6.78) v3(64.77,6.02) v3(64.77,5.26) v3(64.77,4.5) v3(65.02,76.12) v3(65.02,75.36) v3(65.02,74.6) v3(65.02,73.84) v3(65.53,57.45) v3(65.53,56.69) v3(65.53,55.93) v3(65.53,55.17) v3(65.53,6.78) v3(65.53,6.02) v3(65.53,5.26) v3(65.53,4.5) v3(65.79,76.12) v3(65.79,75.36) v3(65.79,74.6) v3(65.79,73.84) v3(66.29,57.45) v3(66.29,56.69) v3(66.29,55.93) v3(66.29,55.17) v3(66.29,32.44) v3(66.29,31.67) v3(66.29,30.91) v3(66.29,30.15) v3(66.29,25.45) v3(66.29,24.69) v3(66.29,23.93) v3(66.29,23.16) v3(66.29,6.78) v3(66.29,6.02) v3(66.29,5.26) v3(66.29,4.5) v3(66.42,17.32) v3(66.42,16.56) v3(66.42,15.8) v3(66.42,15.04) v3(67.06,32.44) v3(67.06,31.67) v3(67.06,30.91) v3(67.06,30.15) v3(67.06,25.45) v3(67.06,24.69) v3(67.06,23.93) v3(67.06,23.16) v3(67.18,17.32) v3(67.18,16.56) v3(67.18,15.8) v3(67.18,15.04) v3(67.82,32.44) v3(67.82,31.67) v3(67.82,30.91) v3(67.82,30.15) v3(67.82,25.45) v3(67.82,24.69) v3(67.82,23.93) v3(67.82,23.16) v3(67.94,17.32) v3(67.94,16.56) v3(67.94,15.8) v3(67.94,15.04) v3(68.58,32.44) v3(68.58,31.67) v3(68.58,30.91) v3(68.58,30.15) v3(68.58,25.45) v3(68.58,24.69) v3(68.58,23.93) v3(68.58,23.16) v3(68.71,17.32) v3(68.71,16.56) v3(68.71,15.8) v3(68.71,15.04) v3(68.96,49.83) v3(68.96,49.07) v3(68.96,48.31) v3(68.96,47.55) v3(69.72,49.83) v3(69.72,49.07) v3(69.72,48.31) v3(69.72,47.55) v3(70.49,49.83) v3(70.49,49.07) v3(70.49,48.31) v3(70.49,47.55) v3(70.61,95.3) v3(70.61,94.54) v3(70.61,93.78) v3(70.61,93.02) v3(71.25,49.83) v3(71.25,49.07) v3(71.25,48.31) v3(71.25,47.55) v3(71.37,95.3) v3(71.37,94.54) v3(71.37,93.78) v3(71.37,93.02) v3(72.14,95.3) v3(72.14,94.54) v3(72.14,93.78) v3(72.14,93.02) v3(72.9,95.3) v3(72.9,94.54) v3(72.9,93.78) v3(72.9,93.02) v3(77.22,13) v3(77.22,12.24) v3(77.22,11.48) v3(77.22,10.72) v3(77.72,56.95) v3(77.72,56.19) v3(77.72,55.42) v3(77.72,54.66) v3(77.98,13) v3(77.98,12.24) v3(77.98,11.48) v3(77.98,10.72) v3(78.49,56.95) v3(78.49,56.19) v3(78.49,55.42) v3(78.49,54.66) v3(78.49,46.91) v3(78.49,46.15) v3(78.49,45.39) v3(78.49,44.63) v3(78.74,13) v3(78.74,12.24) v3(78.74,11.48) v3(78.74,10.72) v3(79.25,56.95) v3(79.25,56.19) v3(79.25,55.42) v3(79.25,54.66) v3(79.25,46.91) v3(79.25,46.15) v3(79.25,45.39) v3(79.25,44.63) v3(79.5,13) v3(79.5,12.24) v3(79.5,11.48) v3(79.5,10.72) v3(80.01,56.95) v3(80.01,56.19) v3(80.01,55.42) v3(80.01,54.66) v3(80.01,46.91) v3(80.01,46.15) v3(80.01,45.39) v3(80.01,44.63) v3(80.77,46.91) v3(80.77,46.15) v3(80.77,45.39) v3(80.77,44.63) v3(81.66,71.42) v3(81.66,70.66) v3(81.66,69.9) v3(81.66,69.14) v3(82.42,71.42) v3(82.42,70.66) v3(82.42,69.9) v3(82.42,69.14) v3(83.19,71.42) v3(83.19,70.66) v3(83.19,69.9) v3(83.19,69.14) v3(83.95,71.42) v3(83.95,70.66) v3(83.95,69.9) v3(83.95,69.14) v3(86.23,79.3) v3(86.23,78.54) v3(86.23,77.78) v3(86.23,77.01) v3(86.23,6.15) v3(86.23,5.38) v3(86.23,4.62) v3(86.23,3.86) v3(87,79.3) v3(87,78.54) v3(87,77.78) v3(87,77.01) v3(87,6.15) v3(87,5.38) v3(87,4.62) v3(87,3.86) v3(87.76,79.3) v3(87.76,78.54) v3(87.76,77.78) v3(87.76,77.01) v3(87.76,6.15) v3(87.76,5.38) v3(87.76,4.62) v3(87.76,3.86) v3(87.88,71.04) v3(87.88,70.28) v3(87.88,69.52) v3(87.88,68.76) v3(88.52,79.3) v3(88.52,78.54) v3(88.52,77.78) v3(88.52,77.01) v3(88.52,6.15) v3(88.52,5.38) v3(88.52,4.62) v3(88.52,3.86) v3(88.65,71.04) v3(88.65,70.28) v3(88.65,69.52) v3(88.65,68.76) v3(89.41,71.04) v3(89.41,70.28) v3(89.41,69.52) v3(89.41,68.76) v3(90.17,71.04) v3(90.17,70.28) v3(90.17,69.52) v3(90.17,68.76) v3(93.73,93.78) v3(93.73,93.02) v3(93.73,92.25) v3(93.73,91.49) v3(94.36,6.15) v3(94.36,5.38) v3(94.36,4.62) v3(94.36,3.86) v3(94.49,93.78) v3(94.49,93.02) v3(94.49,92.25) v3(94.49,91.49) v3(95.12,6.15) v3(95.12,5.38) v3(95.12,4.62) v3(95.12,3.86) v3(95.25,93.78) v3(95.25,93.02) v3(95.25,92.25) v3(95.25,91.49) v3(95.88,6.15) v3(95.88,5.38) v3(95.88,4.62) v3(95.88,3.86) v3(96.01,93.78) v3(96.01,93.02) v3(96.01,92.25) v3(96.01,91.49) v3(96.27,57.96) v3(96.27,57.2) v3(96.27,56.44) v3(96.27,55.68) v3(96.52,68.12) v3(96.52,67.36) v3(96.52,66.6) v3(96.52,65.84) v3(96.65,6.15) v3(96.65,5.38) v3(96.65,4.62) v3(96.65,3.86) v3(97.03,57.96) v3(97.03,57.2) v3(97.03,56.44) v3(97.03,55.68) v3(97.28,68.12) v3(97.28,67.36) v3(97.28,66.6) v3(97.28,65.84) v3(97.79,57.96) v3(97.79,57.2) v3(97.79,56.44) v3(97.79,55.68) v3(98.04,68.12) v3(98.04,67.36) v3(98.04,66.6) v3(98.04,65.84) v3(98.55,57.96) v3(98.55,57.2) v3(98.55,56.44) v3(98.55,55.68) v3(98.81,68.12) v3(98.81,67.36) v3(98.81,66.6) v3(98.81,65.84)
VIN: length 149.1
  Top Layer w0.508: R1.2 70.11,98.46 v3(70.13,98.48)
  Top Layer w1.524: SW1.2 93.09,32.82 91.31,31.04 91.31,24.82 92.86,23.27 锂电池输入.1
  Bottom Layer w0.508: 85.09,85.58 85.09,95.81 82.42,98.48 v3(70.13,98.48)
  Bottom Layer w1.016: 85.19,85.48 93.85,76.81 93.85,24.16 94.75,23.27 锂电池输入.1
ADC0: length 16.2
  Top Layer w0.508: U1.25 R2.2 35.69,87.16 R1.1
ADC1: length 44.4
  Top Layer w0.737: 光照传感器.1 13.21,96.32 25.02,84.51 U1.26
BLUE_RXD: length 40.3
  Top Layer w0.508: 蓝牙模块.4 U1.27
BLUE_TXD: length 40.3
  Top Layer w0.508: 蓝牙模块.3 U1.28
BUZZER_IO: length 46.3
  Top Layer w0.508: U1.35 37.97,57.07 37.97,49.45 33.4,44.88 14.86,44.88 11.94,41.96 有源蜂鸣器.2
DHT11_DATA: length 59.8
  Top Layer w0.508: U1.36 39.62,56.19 39.62,37.9 36.32,34.59 14.35,34.59 11.94,32.18 温湿度传感器.2
DS1302_IO: length 20.8
  Top Layer w0.508: DS1302实时时钟.2 73.15,69.27 U1.9
DS1302_RST: length 20.8
  Top Layer w0.508: DS1302实时时钟.1 73.15,66.73 U1.8
DS1302_SCLK: length 20.8
  Top Layer w0.508: DS1302实时时钟.3 73.15,71.81 U1.10
I2C1_SCL: length 43.5
  Bottom Layer w0.508: 51.69,41 51.69,75.87 U1.14
I2C1_SDA: length 45
  Top Layer w0.508: OLED1.4 54.23,80.95 U1.15
LED_IO: length 80.6
  Top Layer w0.254: v3(50.57,55.57) 50.69,55.57 v3(53.09,57.96) ; v3(46.86,51.87) 45.34,50.34 45.34,27.99
  Top Layer w0.508: LED1.1 12.19,20.12 14.1,22.02 39.37,22.02 45.34,27.99
  Bottom Layer w0.254: U1.5 54.23,59.11 v3(53.09,57.96) ; v3(46.86,51.87) v3(50.57,55.57)
LU6288_BUSY: length 40
  Top Layer w0.508: LU6288语音合成模块.1 89.53,63.68 87.63,65.58 v3(66.55,65.58)
  Bottom Layer w0.508: U1.11 v3(66.55,65.58)
LU6288_RXD: length 35.6
  Top Layer w0.508: LU6288语音合成模块.4 80.14,61.65 U1.6
LU6288_TXD: length 35.6
  Top Layer w0.508: LU6288语音合成模块.3 80.14,64.19 U1.7
MOTOR_INA: length 43.6
  Top Layer w0.508: L9110H风扇.3 91.31,87.05 U1.16
MOTOR_INB: length 43.6
  Top Layer w0.508: L9110H风扇.4 91.31,89.59 U1.17
SERVO_IO: length 50.1
  Bottom Layer w0.508: 舵机.1 30.1,90.86 47.88,90.86 52.96,85.78 59.18,85.78 59.94,85.01 59.94,79.05 U1.12
SPI1_MISO: length 27.7
  Bottom Layer w0.508: W25Q64存储模块.3 30.35,72.82 31.37,71.81 U1.31
SPI1_MOSI: length 29
  Top Layer w0.508: W25Q64存储模块.6 35.05,65.2 39.12,69.27 U1.32
SPK+: length 7
  Top Layer w0.508: 喇叭.1 96.37,47.17 LU6288语音合成模块.6
SPK-: length 7.1
  Top Layer w0.508: 喇叭.2 96.13,44.63 LU6288语音合成模块.7
SW1: length 52.6
  Top Layer w0.508: U1.1 57.78,20.98 SW3.2 SW3.1
SW2: length 65.2
  Top Layer w0.508: U1.2 55.75,49.45 55.75,29.26 34.63,8.14 SW4.2 SW4.1
SW3: length 53.7
  Top Layer w0.508: SW6.1 SW6.2 60.99,50.82 U1.3
SW4: length 60.2
  Top Layer w0.508: SW7.2 SW7.1 70.54,43.81 U1.4
W25Q64_CLK: length 30
  Top Layer w0.508: W25Q64存储模块.5 25.15,67.74 31.75,74.35 U1.30
W25Q64_CS: length 27.9
  Top Layer w0.508: W25Q64存储模块.2 41.02,75.36 U1.29
WEIGHT_DT: length 39.6
  Top Layer w0.508: U1.33 33.15,57.33 v3(27.43,57.33) ; 称重模块.3 20.95,54.79 v3(23.5,57.33)
  Bottom Layer w0.508: v3(23.5,57.33) v3(27.43,57.33)
WEIGHT_SCK: length 39.6
  Top Layer w0.508: v3(27.56,54.79) 33.15,54.79 U1.34 ; v3(23.5,54.79) 20.95,52.25 称重模块.2
  Bottom Layer w0.508: v3(23.5,54.79) v3(27.56,54.79)
$1N178: length 46.3
  Top Layer w1.524: XL2608升压模块.7 84.07,33.07 85.82,34.82 86.55,34.82 ; SW1.3 86.55,34.82 ; 86.55,34.82 86.61,34.75 XL2608升压模块.8

## Copper pours and planes (outline as drawn; the poured copper is in the pictures)
GND on Top Layer: -16.89,107.37 140.84,107.37 140.84,-23.95 -16.89,-23.95
GND on Bottom Layer: -8.64,103.94 117.86,103.94 117.86,-8.71 -8.64,-8.71

Small or netless copper shapes (teardrops, artwork), in the pictures only: 91 on Top Layer, 31 on Bottom Layer
